# EAGLE design CAN Hat (EAGLE 7.7.0)
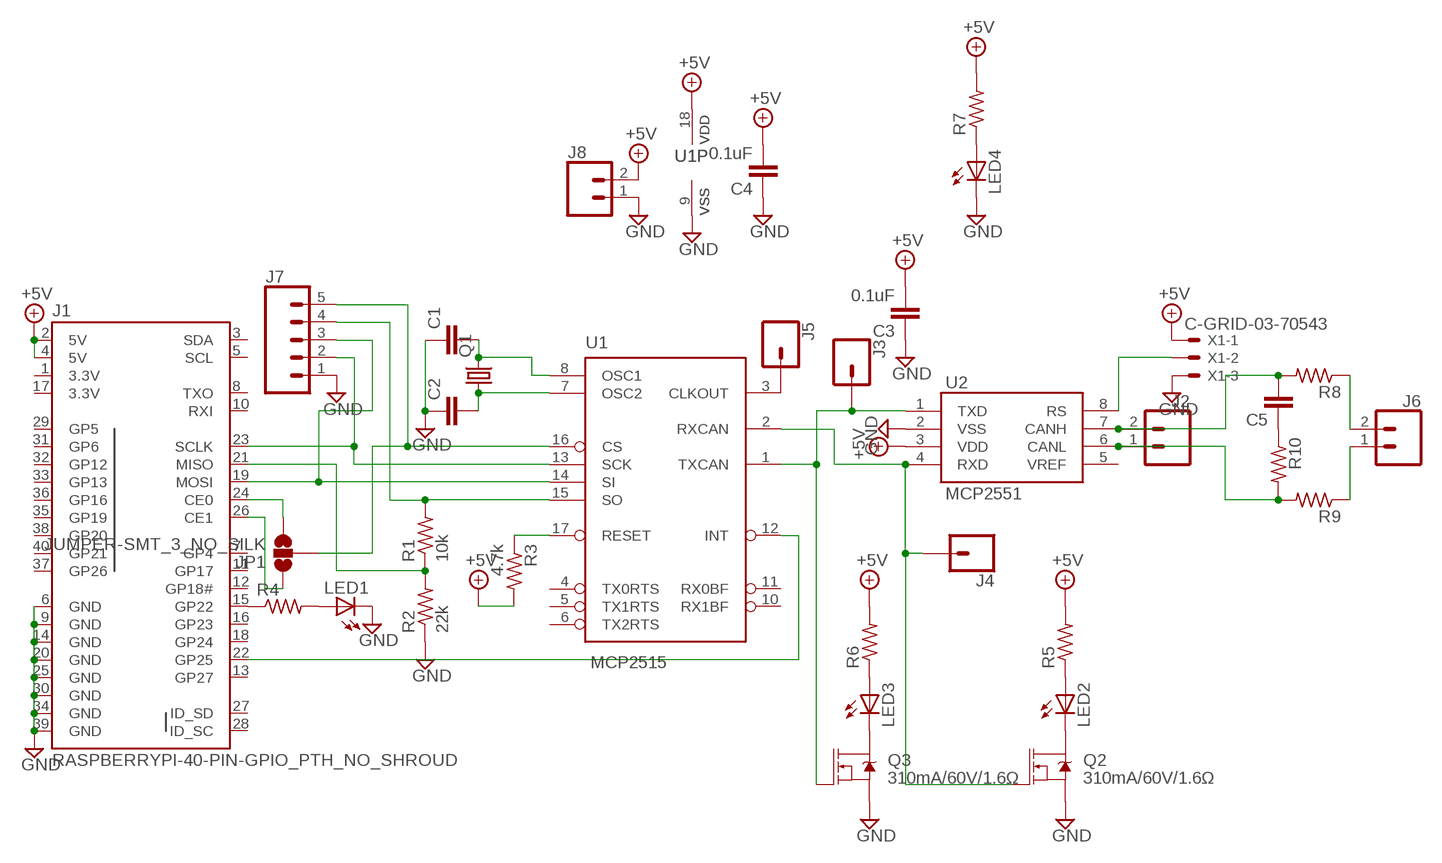
[diagram p0: schematic, sheet 1]

## Parts
C1  C-EUC1206  [C1206]
C2  C-EUC1206  [C1206]
C3  0.1uF  C-EUC1206  [C1206]
C4  0.1uF  C-EUC1206  [C1206]
C5  C-EUC1206  [C1206]
J1  RASPBERRYPI-40-PIN-GPIO_PTH_NO_SHROUD  [2X20]
J2  CONN_02  [1X02]
J3  CONN_01  [1X01]
J4  CONN_01  [1X01]
J5  CONN_01  [1X01]
J6  CONN_02  [1X02]
J7  CONN_05  [1X05]
J8  CONN_023.5MM  [SCREWTERMINAL-3.5MM-2]
JP1  JUMPER-SMT_3_NO_SILK  [SMT-JUMPER_3_NO_SILK]
LED1  LED3MM  [LED3MM]
LED2  LED3MM  [LED3MM]
LED3  LED3MM  [LED3MM]
LED4  LED3MM  [LED3MM]
Q1  CRYSTALHC49U70  [HC49U70]
Q2  310mA/60V/1.6Ω  MOSFET-NCH-2N7002PW  [SOT323]
Q3  310mA/60V/1.6Ω  MOSFET-NCH-2N7002PW  [SOT323]
R1  10k  R-US_R1206  [R1206]
R2  22k  R-US_R1206  [R1206]
R3  4.7k  R-US_R1206  [R1206]
R4  R-US_R1206  [R1206]
R5  R-US_R1206  [R1206]
R6  R-US_R1206  [R1206]
R7  R-US_R1206  [R1206]
R8  R-US_R1206  [R1206]
R9  R-US_R1206  [R1206]
R10  R-US_R1206  [R1206]
U1  MCP2515  MCP2515(MCP2510)P  [DIP18]
U2  MCP2551  [SO08]
X1  C-GRID-03-70543  [70543-03]

## Nets
+5V: C3.2 C4.2 J1.2(5V) J1.4(5V) J8.2 R3.2 R5.2 R6.2 R7.2 U1.18(VDD) U2.3(VDD) X1.1
GND: C1.1 C2.1 C3.1 C4.1 J1.6(GND) J1.9(GND) J1.14(GND) J1.20(GND) J1.25(GND) J1.30(GND) J1.34(GND) J1.39(GND) J7.1 J8.1 LED1.K(C) LED4.K(C) Q2.2(S) Q3.2(S) R2.1 U1.9(VSS) U2.2(VSS) X1.3
N$1: J4.1 Q2.1(G) U1.2(RXCAN) U2.4(RXD)
N$2: J3.1 Q3.1(G) U1.1(TXCAN) U2.1(TXD)
N$3: C2.2 Q1.1 U1.7(OSC2)
N$4: C1.2 Q1.2 U1.8(OSC1)
N$5: LED4.A R7.1
N$6: J7.5 JP1.2 U1.16(CS)
N$7: J1.24(CE0) JP1.3
N$8: J1.26(CE1) JP1.1
N$9: R3.1 U1.17(RESET)
N$10: J1.23(SCLK) J7.2 U1.13(SCK)
N$11: J1.19(MOSI) J7.3 U1.14(SI)
N$12: J1.21(MISO) R1.1 R2.2
N$13: J1.22(GP25) U1.12(INT)
N$14: U2.8(RS) X1.2
N$15: J1.15(GP22) R4.1
N$16: LED1.A R4.2
N$17: J2.1 R9.2 R10.2 U2.6(CANL)
N$18: C5.2 J2.2 R8.2 U2.7(CANH)
N$19: LED2.K(C) Q2.3(D)
N$20: LED2.A R5.1
N$21: LED3.A R6.1
N$22: LED3.K(C) Q3.3(D)
N$23: J5.1 U1.3(CLKOUT)
N$24: J6.1 R9.1
N$25: J6.2 R8.1
N$114: J7.4 R1.2 U1.15(SO)
N$115: C5.1 R10.1
Unconnected: J1.3(SDA) J1.5(SCL) J1.7(GP4) J1.8(TXO) J1.10(RXI) J1.11(GP17) J1.12(GP18#) J1.13(GP27) J1.16(GP23) J1.18(GP24) J1.27(ID_SD) J1.28(ID_SC) J1.29(GP5) J1.31(GP6) J1.32(GP12) J1.33(GP13) J1.35(GP19) J1.36(GP16) J1.37(GP26) J1.38(GP20) J1.40(GP21) U1.4(TX0RTS) U1.5(TX1RTS) U1.6(TX2RTS) U1.10(RX1BF) U1.11(RX0BF) U2.5(VREF)

## Power pins joined to a net without a drawn wire
3.3V: J1.1(3.3V) J1.17(3.3V)

## Library data of the parts
C1-C5 = resistor:C-EU: CAPACITOR, European symbol
J1 = SparkFun-Connectors:RASPBERRYPI-40-PIN-GPIO: Raspberry Pi GPIO Header 2x20 pin connector, as found on B, B+, A+ models. Both shrouded PTH and SMT versions available. SparkFun Products: GPIO Shrouded Header <https://www.sparkfun.com/products/13054>- PTH SparkFun Pi Wedge (Preassembled) <https://www.sparkfun.com/products/13717>
J2 J6 = SparkFun-Connectors:CONN_02: Multi connection point. Often used as Generic Header-pin footprint for 0.1 inch spaced/style header connections On any of the 0.1 inch spaced packages, you can populate with these: Break Away Headers - Straight <https://www.sparkfun.com/products/116> (PRT-00116) Break Away Male Headers - Right Angle <https://www.sparkfun.com/products/553> (PRT-00553) Female Headers <https://www.sparkfun.com/products/115> (PRT-00115) Break Away Headers - Machine Pin <https://www.sparkfun.com/products/117> (PRT-00117) Break Away Female Headers - Swiss Machine Pin <https://www.sparkfun.com/products/743> (PRT-00743) For SCREWTERMINALS and SPRING TERMINALS visit here: Screw Terimnals on SparkFun.com <https://www.sparkfun.com/search/results?term=Screw+Terminals> (5mm/3.5mm/2.54mm spacing) This device is also useful as a general connection point to wire up your design to another part of your project. Our various solder wires solder well into these plated through hole pads. Hook-Up Wire - Assortment (Stranded, 22 AWG) <https://www.sparkfun.com/products/11375> (PRT-11375) Hook-Up Wire - Assortment (Solid Core, 22 AWG) <https://www.sparkfun.com/products/11367> (PRT-11367) View the entire wire category on our website here <https://www.sparkfun.com/categories/141> Special notes: Molex polarized connector foot print use with: PRT-08233 with associated crimp pins and housings. 2.54_SCREWTERM for use with PRT-10571. 3.5mm Screw Terminal footprints for PRT-08084 5mm Screw Terminal footprints for use with PRT-08432
J3-J5 = SparkFun-Connectors:CONN_01: Single connection point. Often used as Generic Header-pin footprint for 0.1 inch spaced/style header connections On any of the 0.1 inch spaced packages, you can populate with these: Break Away Headers - Straight <https://www.sparkfun.com/products/116> (PRT-00116) Break Away Male Headers - Right Angle <https://www.sparkfun.com/products/553> (PRT-00553) Female Headers <https://www.sparkfun.com/products/115> (PRT-00115) Break Away Headers - Machine Pin <https://www.sparkfun.com/products/117> (PRT-00117) Break Away Female Headers - Swiss Machine Pin <https://www.sparkfun.com/products/743> (PRT-00743) This device is also useful as a general connection point to wire up your design to another part of your project. Our various solder wires solder well into these plated through hole pads. Hook-Up Wire - Assortment (Stranded, 22 AWG) <https://www.sparkfun.com/products/11375> (PRT-11375) Hook-Up Wire - Assortment (Solid Core, 22 AWG) <https://www.sparkfun.com/products/11367> (PRT-11367) View the entire wire category on our website here <https://www.sparkfun.com/categories/141> Special notes: SMTSO-256-ET is a "flush mount" nut for a 4-40 screw. We mostly use this on specialty testbeds; it is a nice way to connect hardware to your PCB at an adjustable hieght. Also note, the SNAP packages are for using a snappable style connector. We sell a baggie of snaps and they are also used on two LilyPad designs: Snap Assortment - 30 pack (male and female) <https://www.sparkfun.com/products/11347> (DEV-11347) LilyPad Arduino SimpleSnap <https://www.sparkfun.com/products/10941> (DEV-10941) LilyPad SimpleSnap Protoboard <https://www.sparkfun.com/products/10940> (DEV-10940)
J7 = SparkFun-Connectors:CONN_05: Multi connection point. Often used as Generic Header-pin footprint for 0.1 inch spaced/style header connections On any of the 0.1 inch spaced packages, you can populate with these: Break Away Headers - Straight <https://www.sparkfun.com/products/116> (PRT-00116) Break Away Male Headers - Right Angle <https://www.sparkfun.com/products/553> (PRT-00553) Female Headers <https://www.sparkfun.com/products/115> (PRT-00115) Break Away Headers - Machine Pin <https://www.sparkfun.com/products/117> (PRT-00117) Break Away Female Headers - Swiss Machine Pin <https://www.sparkfun.com/products/743> (PRT-00743) For SCREWTERMINALS and SPRING TERMINALS visit here: Screw Terimnals on SparkFun.com <https://www.sparkfun.com/search/results?term=Screw+Terminals> (5mm/3.5mm/2.54mm spacing) This device is also useful as a general connection point to wire up your design to another part of your project. Our various solder wires solder well into these plated through hole pads. Hook-Up Wire - Assortment (Stranded, 22 AWG) <https://www.sparkfun.com/products/11375> (PRT-11375) Hook-Up Wire - Assortment (Solid Core, 22 AWG) <https://www.sparkfun.com/products/11367> (PRT-11367) View the entire wire category on our website here <https://www.sparkfun.com/categories/141> Special notes: Molex polarized connector foot print use with SKU : PRT-08231 with associated crimp pins and housings. 1MM SMD Version SKU: PRT-10208
J8 = SparkFun-Connectors:CONN_02: Multi connection point. Often used as Generic Header-pin footprint for 0.1 inch spaced/style header connections On any of the 0.1 inch spaced packages, you can populate with these: Break Away Headers - Straight <https://www.sparkfun.com/products/116> (PRT-00116) Break Away Male Headers - Right Angle <https://www.sparkfun.com/products/553> (PRT-00553) Female Headers <https://www.sparkfun.com/products/115> (PRT-00115) Break Away Headers - Machine Pin <https://www.sparkfun.com/products/117> (PRT-00117) Break Away Female Headers - Swiss Machine Pin <https://www.sparkfun.com/products/743> (PRT-00743) For SCREWTERMINALS and SPRING TERMINALS visit here: Screw Terimnals on SparkFun.com <https://www.sparkfun.com/search/results?term=Screw+Terminals> (5mm/3.5mm/2.54mm spacing) This device is also useful as a general connection point to wire up your design to another part of your project. Our various solder wires solder well into these plated through hole pads. Hook-Up Wire - Assortment (Stranded, 22 AWG) <https://www.sparkfun.com/products/11375> (PRT-11375) Hook-Up Wire - Assortment (Solid Core, 22 AWG) <https://www.sparkfun.com/products/11367> (PRT-11367) View the entire wire category on our website here <https://www.sparkfun.com/categories/141> Special notes: Molex polarized connector foot print use with: PRT-08233 with associated crimp pins and housings. 2.54_SCREWTERM for use with PRT-10571. 3.5mm Screw Terminal footprints for PRT-08084 5mm Screw Terminal footprints for use with PRT-08432; PROD_ID: CONN-08399
JP1 = SparkFun-Jumpers:JUMPER-SMT_3_NO: Normally open jumper This jumper has three pads in close proximity to each other. Apply solder to close the connection(s).
LED1-LED4 = led:LED: LED OSRAM: - CHIPLED LG R971, LG N971, LY N971, LG Q971, LY Q971, LO R971, LY R971 LH N974, LH R974 LS Q976, LO Q976, LY Q976 LO Q996 - Hyper CHIPLED LW Q18S LB Q993, LB Q99A, LB R99A - SideLED LS A670, LO A670, LY A670, LG A670, LP A670 LB A673, LV A673, LT A673, LW A673 LH A674 LY A675 LS A676, LA A676, LO A676, LY A676, LW A676 LS A679, LY A679, LG A679 - Hyper Micro SIDELED® LS Y876, LA Y876, LO Y876, LY Y876 LT Y87S - SmartLED LW L88C, LW L88S LB L89C, LB L89S, LG L890 LS L89K, LO L89K, LY L89K LS L896, LA L896, LO L896, LY L896 - TOPLED LS T670, LO T670, LY T670, LG T670, LP T670 LSG T670, LSP T670, LSY T670, LOP T670, LYG T670 LG T671, LOG T671, LSG T671 LB T673, LV T673, LT T673, LW T673 LH T674 LS T676, LA T676, LO T676, LY T676, LB T676, LH T676, LSB T676, LW T676 LB T67C, LV T67C, LT T67C, LS T67K, LO T67K, LY T67K, LW E67C LS E67B, LA E67B, LO E67B, LY E67B, LB E67C, LV E67C, LT E67C LW T67C LS T679, LY T679, LG T679 LS T770, LO T770, LY T770, LG T770, LP T770 LB T773, LV T773, LT T773, LW T773 LH T774 LS E675, LA E675, LY E675, LS T675 LS T776, LA T776, LO T776, LY T776, LB T776 LHGB T686 LT T68C, LB T68C - Hyper Mini TOPLED® LB M676 - Mini TOPLED Santana® LG M470 LS M47K, LO M47K, LY M47K Source: http://www.osram.convergy.de LUXEON: - LUMILED® LXK2-PW12-R00, LXK2-PW12-S00, LXK2-PW14-U00, LXK2-PW14-V00 LXK2-PM12-R00, LXK2-PM12-S00, LXK2-PM14-U00 LXK2-PE12-Q00, LXK2-PE12-R00, LXK2-PE12-S00, LXK2-PE14-T00, LXK2-PE14-U00 LXK2-PB12-K00, LXK2-PB12-L00, LXK2-PB12-M00, LXK2-PB14-N00, LXK2-PB14-P00, LXK2-PB14-Q00 LXK2-PR12-L00, LXK2-PR12-M00, LXK2-PR14-Q00, LXK2-PR14-R00 LXK2-PD12-Q00, LXK2-PD12-R00, LXK2-PD12-S00 LXK2-PH12-R00, LXK2-PH12-S00 LXK2-PL12-P00, LXK2-PL12-Q00, LXK2-PL12-R00 Source: www.luxeon.com KINGBRIGHT: KA-3528ASYC Source: www.kingbright.com
Q1 = crystal:CRYSTAL: CRYSTAL; OC_FARNELL: unknown; OC_NEWARK: unknown
Q2 Q3 = SparkFun-DiscreteSemi:MOSFET-NCH: N-channel MOSFETs Voltage controlled devices that allow control of high current outputs. SparkFun Products: SparkFun OpenScale <https://www.sparkfun.com/products/13261> SparkFun Digital Sandbox <https://www.sparkfun.com/products/12651> SparkFun Monster Moto Shield <https://www.sparkfun.com/products/10182> SparkFun MOSFET Power Controller <https://www.sparkfun.com/products/11214>; PROD_ID: TRANS-11151
R1-R10 = resistor:R-US_: RESISTOR, American symbol
U1 = SparkFun-IC-Comms:MCP2515(MCP2510): CAN controller with SPI interface The MCP2515 controller supercedes the MCP2510 while addressing all errata associated with it. The two devices are pin compatible, either can be used with this device. 18-pin package SOIC Simple SPI interface to any MCU. One-shot mode ensures message transmission is attempted only once Databyte filtering Start-of-Frame (SOF) output Low-power CMOS Technology Datasheet <http://www.sparkfun.com/datasheets/DevTools/Arduino/MCP2515.pdf> SparkFun Products CAN-BUS Shield <https://www.sparkfun.com/products/13262> (DEV-13262); PROD_ID: NA-XXXXX
U2 = SparkFun-IC-Comms:MCP2551: MCP2551 High Speed CAN Transceiver High speed CAN transceiver Datasheet <http://www.sparkfun.com/datasheets/DevTools/Arduino/MCP2551.pdf> SparkFun Products CAN-BUS Shield <https://www.sparkfun.com/products/13262> (DEV-13262) SparkFun OBD-II UART <https://www.sparkfun.com/products/9555> (WIG-09555); PROD_ID: IC-09907
X1 = con-molex:C-GRID-03: CONNECTOR wire to board 2.54 mm (0.100") pitch header; OC_FARNELL: unknown; OC_NEWARK: unknown

## Board
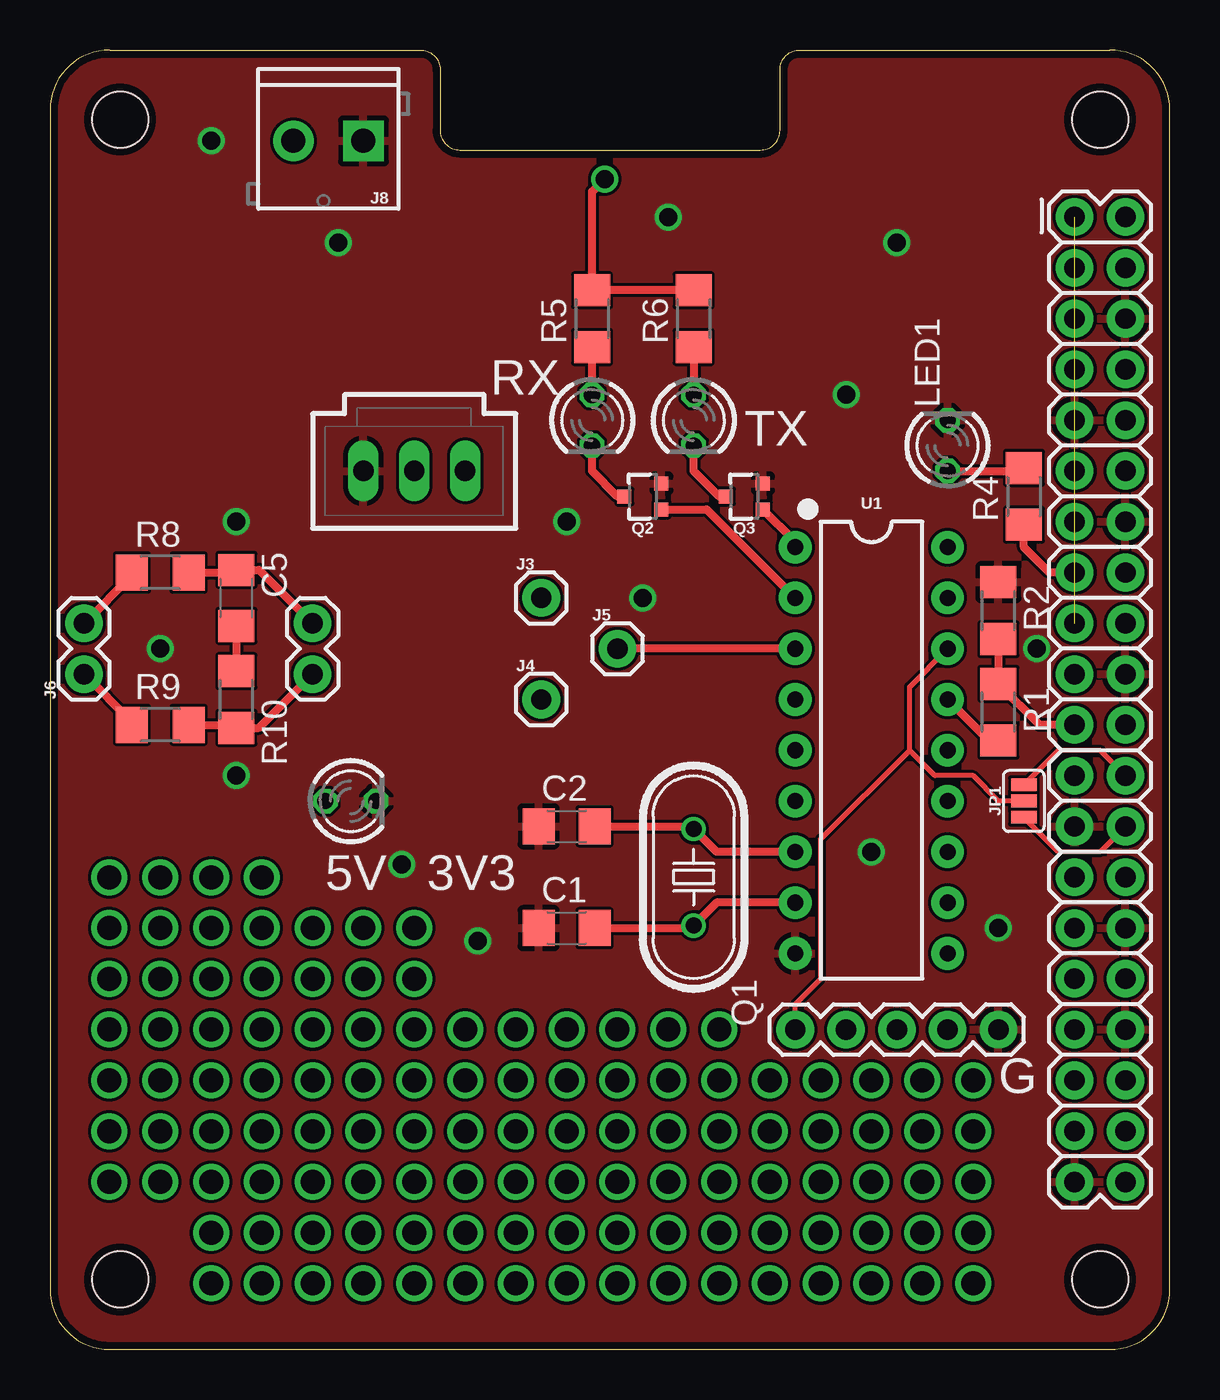
[diagram p1: board, top side]
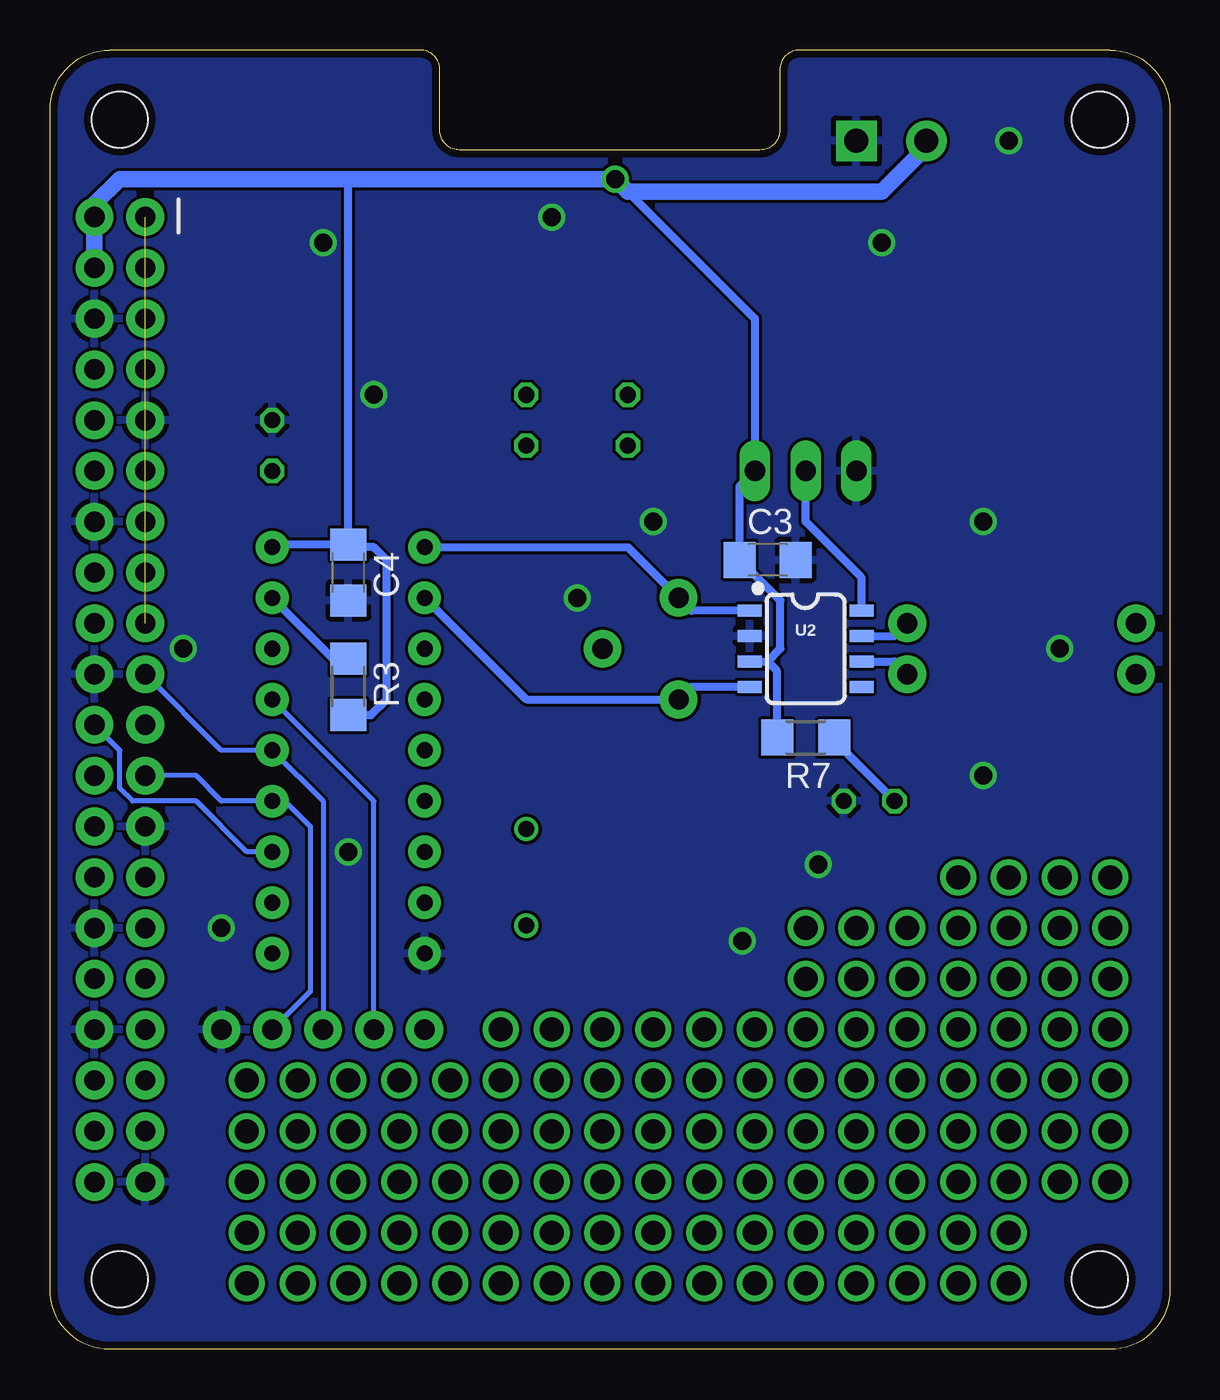
[diagram p2: board, bottom side, seen from below]

Size 55.99 x 65 mm. Coordinates in mm from the lower left corner, seen from the top.
Outline: 0,62 0,3 arc90 3,0 53,0 arc90 55.99,3 55.99,62 arc90 53,65 37.49,65 arc90 36.5,64.01 36.5,60.98 arc-90 35.51,59.99 20.5,59.99 arc-90 19.51,60.98 19.51,64.01 arc90 18.52,65 3,65 arc90 0,62
Copper layers (1*16): Top 0.035559375mm / dielectric 1.6mm / Bottom 0.035559375mm
Design rules "oshpark-2layer": minimum track width 6mil, minimum drill 10mil, track to track 6mil, track to pad 6mil, pad to pad 6mil, via to via 6mil, smd to smd 6mil, copper to edge 15mil, drill to drill 6mil, minimum pad ring 5mil, minimum via ring 5mil, stop-mask expansion 2.5mil, vias tented up to drill 0mil, thermal gap 10mil
Holes 2.8 mm at 52.5,61.52 52.5,3.51 3.51,61.52 3.51,3.51

### Footprints (pad centres in the part's own frame; a part is rotated, then mirrored left to right if it is on the bottom)
C1206 = smd 1.6 x 1.8: 1 -1.4,0; 2 1.4,0
2X20 = drill 1.016 pad 1.88: 1 0,0; 2 0,2.54; 3 2.54,0; 4 2.54,2.54; 5 5.08,0; 6 5.08,2.54; 7 7.62,0; 8 7.62,2.54; 9 10.16,0; 10 10.16,2.54; 11 12.7,0; 12 12.7,2.54; 13 15.24,0; 14 15.24,2.54; 15 17.78,0; 16 17.78,2.54; 17 20.32,0; 18 20.32,2.54; 19 22.86,0; 20 22.86,2.54; 21 25.4,0; 22 25.4,2.54; 23 27.94,0; 24 27.94,2.54; 25 30.48,0; 26 30.48,2.54; 27 33.02,0; 28 33.02,2.54; 29 35.56,0; 30 35.56,2.54; 31 38.1,0; 32 38.1,2.54; 33 40.64,0; 34 40.64,2.54; 35 43.18,0; 36 43.18,2.54; 37 45.72,0; 38 45.72,2.54; 39 48.26,0; 40 48.26,2.54
1X02 = drill 1.016 pad 1.88: 1 0,0; 2 2.54,0
1X01 = drill 1.016 pad 1.88: 1 0,0
1X05 = drill 1.016 pad 1.88: 1 0,0; 2 2.54,0; 3 5.08,0; 4 7.62,0; 5 10.16,0
SCREWTERMINAL-3.5MM-2 = drill 1.2 pad 2.032 square: 1 0,0 | drill 1.2 pad 2.032: 2 3.5,0
SMT-JUMPER_3_NO_SILK = smd 0.635 x 1.27: 1 -0.813,0; 2 0,0; 3 0.813,0
LED3MM = drill 0.813 octagon: A -1.27,0; K 1.27,0
HC49U70 = drill 0.813: 1 -2.413,0; 2 2.413,0
SOT323 = smd 0.7 x 0.7: 1 -0.65,-0.925; 2 0.65,-0.925; 3 0,0.925
R1206 = smd 1.6 x 1.803: 1 -1.422,0; 2 1.422,0
DIP18 = drill 0.813 pad 1.626: 1 -10.16,-3.81; 2 -7.62,-3.81; 3 -5.08,-3.81; 4 -2.54,-3.81; 5 0,-3.81; 6 2.54,-3.81; 7 5.08,-3.81; 8 7.62,-3.81; 9 10.16,-3.81; 10 10.16,3.81; 11 7.62,3.81; 12 5.08,3.81; 13 2.54,3.81; 14 0,3.81; 15 -2.54,3.81; 16 -5.08,3.81; 17 -7.62,3.81; 18 -10.16,3.81
SO08 = smd 0.6 x 1.2: 1 -1.905,-2.8; 2 -0.635,-2.8; 3 0.635,-2.8; 4 1.905,-2.8; 5 1.905,2.8; 6 0.635,2.8; 7 -0.635,2.8; 8 -1.905,2.8
70543-03 = drill 1.016 long: 1 -2.54,0; 2 0,0; 3 2.54,0

### Placement (x,y rotation side)
C1  25.83,21.08 0 top
C2  25.83,26.16 0 top
C3  20.12,39.5 180 bottom
C4  41.07,38.86 90 bottom
C5  9.32,37.59 90 top
J1  51.23,56.64 270 top
J2  13.13,33.78 90 top
J3  24.56,37.59 0 top
J4  24.56,32.51 0 top
J5  28.37,35.05 0 top
J6  1.7,33.78 90 top
J7  47.42,16 180 top
J8  15.67,60.45 180 top
JP1  48.69,27.43 90 top
LED1  44.88,45.21 90 top
LED2  27.1,46.48 270 top
LED3  32.18,46.48 270 top
LED4  15.04,27.43 0 top
Q1  32.18,23.62 270 top
Q2  29.64,42.67 90 top
Q3  34.72,42.67 90 top
R1  47.42,31.88 270 top
R2  47.42,36.96 270 top
R3  41.07,33.15 270 bottom
R4  48.69,42.67 90 top
R5  27.1,51.56 90 top
R6  32.18,51.56 90 top
R7  18.21,30.61 180 bottom
R8  5.51,38.86 0 top
R9  5.51,31.24 0 top
R10  9.32,32.51 270 top
U1  41.07,29.97 270 top
U2  18.21,35.05 270 bottom
X1  18.21,43.94 180 top

### Tracks (layer width: path | path; a pad name or v marks a point on that pad's centre or on a via)
3.3V  (1 unrouted)
+5V  (via drill 0.9)
  Top 0.406: v27.74,58.55 27.1,57.91 R5.2 R6.2
  Bottom 0.406: U2.3 20.12,34.42 | 20.12,34.42 19.48,35.05 19.48,37.46 C3.2 21.52,43.18 X1.1 20.75,51.56 27.1,57.91 | R7.2 19.63,33.93 20.12,34.42 | C4.2 44.75,40.26 U1.18 | C4.2 41.07,58.55 | R3.2 39.95,31.72 39.17,32.51 39.17,39.5 39.8,40.13 40.94,40.13 C4.2
  Bottom 0.813: J8.2 12.17,60.14 14.4,57.91 27.1,57.91 v27.74,58.55 41.07,58.55 52.5,58.55 53.77,57.28 J1.2 J1.4
GND  (via drill 0.9)
  other vias: 14.4,55.37 30.91,56.64 42.34,55.37 39.8,47.75 9.32,41.4 9.32,28.7 47.42,21.08 25.83,41.4 41.07,24.89 29.64,37.59 17.58,24.26 21.39,20.45 49.33,35.05 5.51,35.05 8.05,60.45
  pour Bottom: -14.81,-8.13 65.2,-8.13 65.2,76.96 -14.81,76.96
  pour Top: -7.19,73.15 -7.19,-3.05 60.12,-3.05 60.12,73.15
N$1
  Top 0.406: Q2.1 32.83,42.02 U1.2
  Bottom 0.406: U2.4 23.93,33.15 J4.1 32.18,32.51 U1.2
N$2
  Top 0.406: U1.1 37.26,40.41 Q3.1
  Bottom 0.406: U1.1 27.1,40.13 J3.1 23.93,36.96 U2.1
N$3
  Top 0.406: U1.7 33.32,24.89 Q1.1 32.05,26.16 C2.2
N$4
  Top 0.406: U1.8 33.32,22.35 Q1.2 32.05,21.08 C1.2
N$5
  Bottom 0.406: R7.1 16.79,30.46 LED4.A
N$6
  Top 0.254: JP1.2 47.42,27.43 46.15,28.7 44.25,28.7 42.98,29.97 | 42.98,29.97 42.98,33.15 U1.16 | 42.98,29.97 38.53,25.53 38.53,18.54 37.26,17.27 J7.5
N$7
  Top 0.254: J1.24 52.5,29.97 50.42,29.97 JP1.3
N$8
  Top 0.254: J1.26 52.5,24.89 50.42,24.89 JP1.1
N$9
  Bottom 0.406: R3.1 41.86,34.57 U1.17
N$10
  Bottom 0.254: J1.23 48.69,28.7 47.42,27.43 U1.13 44.25,27.43 42.98,26.16 42.98,17.91 J7.2
N$11
  Bottom 0.254: J1.19 47.42,29.97 U1.14 42.34,27.43 J7.3
N$12
  Top 0.406: R2.2 R1.1 49.48,31.24 J1.21
N$13
  Bottom 0.254: U1.12 46.15,24.89 48.69,27.43 51.87,27.43 52.5,28.07 52.5,29.97 J1.22
N$14
  Bottom 0.406: U2.8 15.41,38.6 18.21,41.4 X1.2
N$15
  Top 0.406: J1.15 49.96,38.86 48.69,40.13 R4.1
N$16
  Top 0.406: LED1.A 48.54,43.94 R4.2
N$17
  Top 0.406: R9.2 9.17,31.24 R10.2 10.44,31.09 J2.1
  Bottom 0.406: U2.6 13.77,34.42 J2.1
N$18
  Top 0.406: R8.2 9.19,38.86 C5.2 10.46,38.99 J2.2
  Bottom 0.406: U2.7 13.77,35.69 J2.2
N$19
  Top 0.406: Q2.3 28.37,42.67 27.1,43.94 LED2.K
N$20
  Top 0.406: LED2.A R5.1
N$21
  Top 0.406: R6.1 LED3.A
N$22
  Top 0.406: Q3.3 33.45,42.67 32.18,43.94 LED3.K
N$23
  Top 0.406: U1.3 J5.1
N$24
  Top 0.406: R9.1 4.09,31.39 J6.1
N$25
  Top 0.406: R8.1 4.09,38.71 J6.2
N$26  (via drill 1.2)
  other vias: 8.05,16
N$27  (via drill 1.2)
  other vias: 10.59,16
N$28  (via drill 1.2)
  other vias: 13.13,16
N$29  (via drill 1.2)
  other vias: 15.67,16
N$30  (via drill 1.2)
  other vias: 18.21,16
N$31  (via drill 1.2)
  other vias: 20.75,16
N$32  (via drill 1.2)
  other vias: 23.29,16
N$33  (via drill 1.2)
  other vias: 25.83,16
N$34  (via drill 1.2)
  other vias: 28.37,16
N$35  (via drill 1.2)
  other vias: 8.05,13.46
N$36  (via drill 1.2)
  other vias: 10.59,13.46
N$37  (via drill 1.2)
  other vias: 13.13,13.46
N$38  (via drill 1.2)
  other vias: 15.67,13.46
N$39  (via drill 1.2)
  other vias: 18.21,13.46
N$40  (via drill 1.2)
  other vias: 20.75,13.46
N$41  (via drill 1.2)
  other vias: 23.29,13.46
N$42  (via drill 1.2)
  other vias: 25.83,13.46
N$43  (via drill 1.2)
  other vias: 28.37,13.46
N$44  (via drill 1.2)
  other vias: 8.05,10.92
N$45  (via drill 1.2)
  other vias: 10.59,10.92
N$46  (via drill 1.2)
  other vias: 13.13,10.92
N$47  (via drill 1.2)
  other vias: 15.67,10.92
N$48  (via drill 1.2)
  other vias: 18.21,10.92
N$49  (via drill 1.2)
  other vias: 20.75,10.92
N$50  (via drill 1.2)
  other vias: 23.29,10.92
N$51  (via drill 1.2)
  other vias: 25.83,10.92
N$52  (via drill 1.2)
  other vias: 28.37,10.92
N$53  (via drill 1.2)
  other vias: 8.05,8.38
N$54  (via drill 1.2)
  other vias: 10.59,8.38
N$55  (via drill 1.2)
  other vias: 13.13,8.38
N$56  (via drill 1.2)
  other vias: 15.67,8.38
N$57  (via drill 1.2)
  other vias: 18.21,8.38
N$58  (via drill 1.2)
  other vias: 20.75,8.38
N$59  (via drill 1.2)
  other vias: 23.29,8.38
N$60  (via drill 1.2)
  other vias: 25.83,8.38
N$61  (via drill 1.2)
  other vias: 28.37,8.38
N$62  (via drill 1.2)
  other vias: 8.05,5.84
N$63  (via drill 1.2)
  other vias: 10.59,5.84
N$64  (via drill 1.2)
  other vias: 13.13,5.84
N$65  (via drill 1.2)
  other vias: 15.67,5.84
N$66  (via drill 1.2)
  other vias: 18.21,5.84
N$67  (via drill 1.2)
  other vias: 20.75,5.84
N$68  (via drill 1.2)
  other vias: 23.29,5.84
N$69  (via drill 1.2)
  other vias: 25.83,5.84
N$70  (via drill 1.2)
  other vias: 28.37,5.84
N$71  (via drill 1.2)
  other vias: 5.51,16
N$72  (via drill 1.2)
  other vias: 2.97,16
N$73  (via drill 1.2)
  other vias: 2.97,13.46
N$74  (via drill 1.2)
  other vias: 5.51,13.46
N$75  (via drill 1.2)
  other vias: 5.51,10.92
N$76  (via drill 1.2)
  other vias: 2.97,10.92
N$77  (via drill 1.2)
  other vias: 2.97,8.38
N$78  (via drill 1.2)
  other vias: 5.51,8.38
N$79  (via drill 1.2)
  other vias: 8.05,3.3
N$80  (via drill 1.2)
  other vias: 10.59,3.3
N$81  (via drill 1.2)
  other vias: 13.13,3.3
N$82  (via drill 1.2)
  other vias: 15.67,3.3
N$83  (via drill 1.2)
  other vias: 18.21,3.3
N$84  (via drill 1.2)
  other vias: 20.75,3.3
N$85  (via drill 1.2)
  other vias: 23.29,3.3
N$86  (via drill 1.2)
  other vias: 25.83,3.3
N$87  (via drill 1.2)
  other vias: 28.37,3.3
N$88  (via drill 1.2)
  other vias: 30.91,16
N$89  (via drill 1.2)
  other vias: 33.45,16
N$92  (via drill 1.2)
  other vias: 30.91,13.46
N$93  (via drill 1.2)
  other vias: 33.45,13.46
N$94  (via drill 1.2)
  other vias: 35.99,13.46
N$95  (via drill 1.2)
  other vias: 38.53,13.46
N$96  (via drill 1.2)
  other vias: 30.91,10.92
N$97  (via drill 1.2)
  other vias: 33.45,10.92
N$98  (via drill 1.2)
  other vias: 35.99,10.92
N$99  (via drill 1.2)
  other vias: 38.53,10.92
N$100  (via drill 1.2)
  other vias: 30.91,8.38
N$101  (via drill 1.2)
  other vias: 33.45,8.38
N$102  (via drill 1.2)
  other vias: 35.99,8.38
N$103  (via drill 1.2)
  other vias: 38.53,8.38
N$104  (via drill 1.2)
  other vias: 30.91,5.84
N$105  (via drill 1.2)
  other vias: 33.45,5.84
N$106  (via drill 1.2)
  other vias: 35.99,5.84
N$107  (via drill 1.2)
  other vias: 38.53,5.84
N$108  (via drill 1.2)
  other vias: 30.91,3.3
N$109  (via drill 1.2)
  other vias: 33.45,3.3
N$110  (via drill 1.2)
  other vias: 35.99,3.3
N$111  (via drill 1.2)
  other vias: 38.53,3.3
N$112  (via drill 1.2)
  other vias: 8.05,23.62
N$113  (via drill 1.2)
  other vias: 10.59,23.62
N$114
  Top 0.406: R1.2 46.94,30.46 U1.15
  Bottom 0.254: J7.4 39.8,27.43 U1.15
N$115
  Top 0.406: C5.1 R10.1
N$117  (via drill 1.2)
  other vias: 8.05,21.08
N$118  (via drill 1.2)
  other vias: 10.59,21.08
N$119  (via drill 1.2)
  other vias: 13.13,21.08
N$120  (via drill 1.2)
  other vias: 15.67,21.08
N$121  (via drill 1.2)
  other vias: 18.21,21.08
N$122  (via drill 1.2)
  other vias: 8.05,18.54
N$123  (via drill 1.2)
  other vias: 10.59,18.54
N$124  (via drill 1.2)
  other vias: 13.13,18.54
N$125  (via drill 1.2)
  other vias: 15.67,18.54
N$126  (via drill 1.2)
  other vias: 18.21,18.54
N$127  (via drill 1.2)
  other vias: 5.51,23.62
N$128  (via drill 1.2)
  other vias: 2.97,23.62
N$129  (via drill 1.2)
  other vias: 2.97,21.08
N$130  (via drill 1.2)
  other vias: 5.51,21.08
N$131  (via drill 1.2)
  other vias: 5.51,18.54
N$132  (via drill 1.2)
  other vias: 2.97,18.54
N$134  (via drill 1.2)
  other vias: 41.07,13.46
N$135  (via drill 1.2)
  other vias: 41.07,10.92
N$136  (via drill 1.2)
  other vias: 41.07,8.38
N$137  (via drill 1.2)
  other vias: 41.07,5.84
N$138  (via drill 1.2)
  other vias: 41.07,3.3
N$139  (via drill 1.2)
  other vias: 43.61,3.3
N$140  (via drill 1.2)
  other vias: 43.61,5.84
N$141  (via drill 1.2)
  other vias: 43.61,8.38
N$142  (via drill 1.2)
  other vias: 43.61,10.92
N$143  (via drill 1.2)
  other vias: 43.61,13.46
N$146  (via drill 1.2)
  other vias: 46.15,13.46
N$147  (via drill 1.2)
  other vias: 46.15,10.92
N$148  (via drill 1.2)
  other vias: 46.15,8.38
N$149  (via drill 1.2)
  other vias: 46.15,5.84
N$150  (via drill 1.2)
  other vias: 46.15,3.3

### Text on the board
tPlace: RX | TX | 5V | 3V3 | G